# Altium project arduino_Nano.PrjPcb
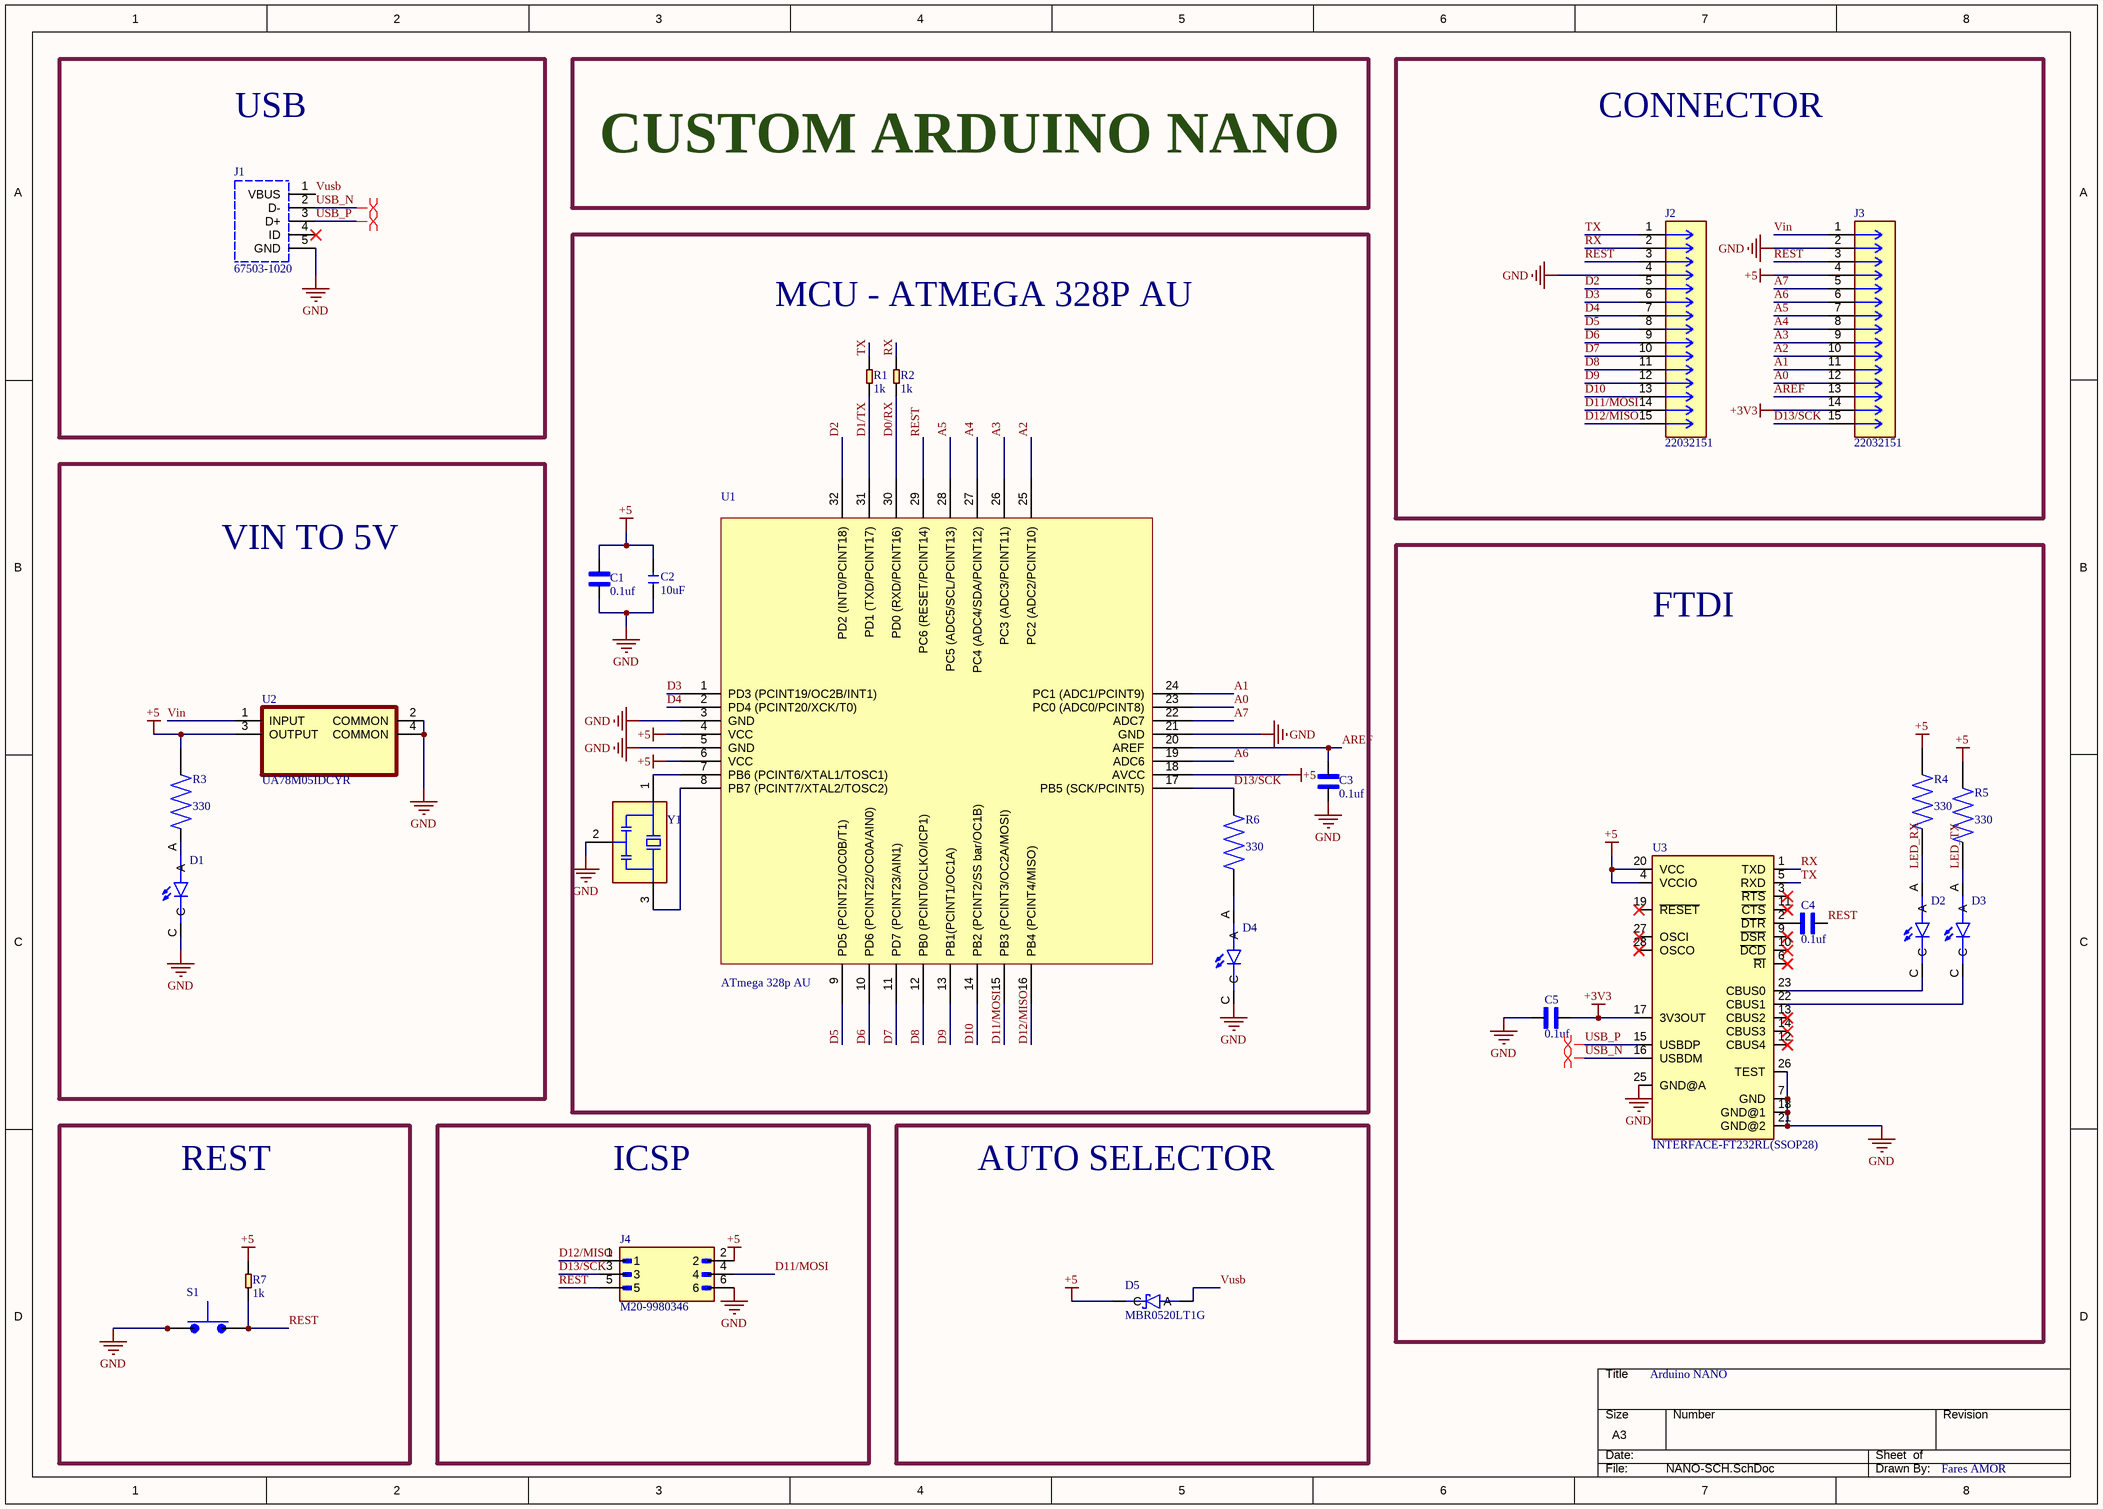
[diagram p0: NANO-SCH.SchDoc]
1 sheet, 26 parts. Net scope: global (net labels, ports and power ports of the same name join across sheets).
Board file: NANO-PCB.PcbDoc

## Sheet NANO-SCH.SchDoc
size A3; SheetNumber: 1; SheetTotal: 1

### Parts
C1  value 0.1uf  [CAPC1005X55N]  (hidden comment: CC0402KRX7R7BB104)
C2  value 10uF  [C0402]  (hidden comment: CERAMIC-10UF-6.3V-20%-X5R(0402))
C3  value 0.1uf  [CAPC1005X55N]  (hidden comment: CC0402KRX7R7BB104)
C4  value 0.1uf  [CAPC1005X55N]  (hidden comment: CC0402KRX7R7BB104)
C5  value 0.1uf  [CAPC1005X55N]  (hidden comment: CC0402KRX7R7BB104)
D1  LTST-C190GKT  [LEDM1608X80]  (value not drawn)
D2  LTST-C190GKT  [LEDM1608X80]  (value not drawn)
D3  LTST-C190GKT  [LEDM1608X80]  (value not drawn)
D4  LTST-C190GKT  [LEDM1608X80]  (value not drawn)
D5  MBR0520LT1G  [SOD3716X135N]
J1  67503-1020  [67503-1020]
J2  22032151  [CONN15X1_22032151_MOL]
J3  22032151  [CONN15X1_22032151_MOL]
J4  M20-9980346  [HARWIN_M20-9980346]
R1  value 1k  [R0402]  (hidden comment: SMD-RES-1K-5%-1/16W(0402))
R2  value 1k  [R0402]  (hidden comment: SMD-RES-1K-5%-1/16W(0402))
R3  value 330  [RESC1005X35N]  (hidden comment: RT0402BRD07330RL)
R4  value 330  [RESC1005X35N]  (hidden comment: RT0402BRD07330RL)
R5  value 330  [RESC1005X35N]  (hidden comment: RT0402BRD07330RL)
R6  value 330  [RESC1005X35N]  (hidden comment: RT0402BRD07330RL)
R7  value 1k  [R0402]  (hidden comment: SMD-RES-1K-5%-1/16W(0402))
S1  SKRPABE010  [SW_SKRPABE010]  (value not drawn)
U1  ATmega 328p AU  [ATmega328P]
U2  UA78M05IDCYR  [SOT230P700X180-4N]
U3  INTERFACE-FT232RL(SSOP28)  [SSOP28-0.65-10.2X5.2MM]
Y1  CSTCE16M0V53-R0  [OSC_CSTCE16M0V53-R0]  (value not drawn)

### Blocks framed on the sheet
USB: J1
CONNECTOR: J2 J3
MCU - ATMEGA 328P AU: C1-C3 D4 R1 R2 R6 U1 Y1
VIN TO 5V: D1 R3 U2
FTDI: C4 C5 D2 D3 R4 R5 U3
REST: R7 S1
ICSP: J4
AUTO SELECTOR: D5

### Nets
+3V3: C5.1 J3.14 U3.17(3V3OUT)
+5: C1.1 C2.2 D5.C J3.4 J4.2 R3.2 R4.2 R5.2 R7.2 U1.4(VCC) U1.6(VCC) U1.18(AVCC) U2.3(OUTPUT) U3.4(VCCIO) U3.20(VCC)
GND: C1.2 C2.1 C3.2 C5.2 D1.C D4.C J1.5(GND) J2.4 J3.2 J4.6 S1.1 S1.2 U1.3(GND) U1.5(GND) U1.21(GND) U2.2(COMMON) U2.4(COMMON) U3.7(GND) U3.18(GND@1) U3.21(GND@2) U3.25(GND@A) U3.26(TEST) Y1.2(GND)
A0: J3.12 U1.23(PC0_(ADC0/PCINT8))
A1: J3.11 U1.24(PC1_(ADC1/PCINT9))
A2: J3.10 U1.25(PC2_(ADC2/PCINT10))
A3: J3.9 U1.26(PC3_(ADC3/PCINT11))
A4: J3.8 U1.27(PC4_(ADC4/SDA/PCINT12))
A5: J3.7 U1.28(PC5_(ADC5/SCL/PCINT13))
A6: J3.6 U1.19(ADC6)
A7: J3.5 U1.22(ADC7)
AREF: C3.1 J3.13 U1.20(AREF)
D0/RX: R2.1 U1.30(PD0_(RXD/PCINT16))
D1/TX: R1.1 U1.31(PD1_(TXD/PCINT17))
D2: J2.5 U1.32(PD2_(INT0/PCINT18))
D3: J2.6 U1.1(PD3_(PCINT19/OC2B/INT1))
D4: J2.7 U1.2(PD4_(PCINT20/XCK/T0))
D5: J2.8 U1.9(PD5_(PCINT21/OC0B/T1))
D6: J2.9 U1.10(PD6_(PCINT22/OC0A/AIN0))
D7: J2.10 U1.11(PD7_(PCINT23/AIN1))
D8: J2.11 U1.12(PB0_(PCINT0/CLKO/ICP1))
D9: J2.12 U1.13(PB1(PCINT1/OC1A))
D10: J2.13 U1.14(PB2_(PCINT2/SS_bar/OC1B))
D11/MOSI: J2.14 J4.4 U1.15(PB3_(PCINT3/OC2A/MOSI))
D12/MISO: J2.15 J4.1 U1.16(PB4_(PCINT4/MISO))
D13/SCK: J3.15 J4.3 R6.2 U1.17(PB5_(SCK/PCINT5))
LED_RX: D2.A R4.1
LED_TX: D3.A R5.1
REST: C4.1 J2.3 J3.3 J4.5 R7.1 S1.3 S1.4 U1.29(PC6_(RESET/PCINT14))
RX: J2.2 R2.2 U3.1(TXD)
TX: J2.1 R1.2 U3.5(RXD)
USB_N: J1.2(D-) U3.16(USBDM)
USB_P: J1.3(D+) U3.15(USBDP)
Vin: J3.1 U2.1(INPUT)
Vusb: D5.A J1.1(VBUS)
NetC4_2: C4.2 U3.2(~{DTR})
NetD1_A: D1.A R3.1
NetD2_C: D2.C U3.23(CBUS0)
NetD3_C: D3.C U3.22(CBUS1)
NetD4_A: D4.A R6.1
NetU1_7: U1.7(PB6_(PCINT6/XTAL1/TOSC1)) Y1.1(IN)
NetU1_8: U1.8(PB7_(PCINT7/XTAL2/TOSC2)) Y1.3(OUT)

Not connected (* = marked no-connect by the designer): J1 4(ID)*; U3 3(~{RTS})* 6(~{RI})* 9(~{DSR})* 10(~{DCD})* 11(~{CTS})* 12(CBUS4)* 13(CBUS2)* 14(CBUS3)* 19(~{RESET})* 27(OSCI)* 28(OSCO)*

### Layout directives
differential pair; differential pair class DIFF90: USB_N, USB_P

### Notes on the sheet
- CUSTOM ARDUINO NANO
- Arduino NANO
- Fares AMOR

### Library data of the parts
C1 C3-C5 = CC0402KRX7R7BB104: 0.1 ÂµF Â±10% 16V Ceramic Capacitor X7R 0402 (1005 Metric); MF: Yageo; SnapEDA_Link: https://www.snapeda.com/parts/CC0402KRX7R7BB104/Yageo/view-part/?ref=snap; Package: 0402 Yageo; MP: CC0402KRX7R7BB104; Check_prices: https://www.snapeda.com/parts/CC0402KRX7R7BB104/Yageo/view-part/?ref=eda
C2 = CERAMIC-10UF-6.3V-20%-X5R(0402): 10 ÂµF Â±20% 6.3V Ceramic Capacitor X5R 0402 (1005 Metric); MF: Yageo; MP: CC0402MRX5R5BB106; SnapEDA_Link: https://www.snapeda.com/parts/CC0402MRX5R5BB106/Yageo/view-part/?ref=snap; Package: 0402 Yageo; Check_prices: https://www.snapeda.com/parts/CC0402MRX5R5BB106/Yageo/view-part/?ref=eda
D1-D4 = LTST-C190GKT: Green 1.6 x 0.8 x 0.8 mm 130Â° Water Clear 6 mcd 2.1 V SMT LED; Value: *; Price: None; Package: None; MP: LTST-C190GKT; Availability: Unavailable
D5 = MBR0520LT1G: Diode Schottky 20 V 500mA Surface Mount SOD-123; MF: ON Semiconductor; SnapEDA_Link: https://www.snapeda.com/parts/MBR0520LT1G/Onsemi/view-part/?ref=snap; Package: SOD-123-2 ON Semiconductor; Value: *; MP: MBR0520LT1G; Check_prices: https://www.snapeda.com/parts/MBR0520LT1G/Onsemi/view-part/?ref=eda
J1 = 67503-1020: Conn Data USB Mini-B SMT Rt Angle Solder Tabs On-The-Go PCB Pegs LF | Molex Incorporated 67503-1020; SnapEDA_Link: https://www.snapeda.com/parts/67503-1020/Molex/view-part/?ref=snap; Package: None; Value: *; MF: Molex; MP: 67503-1020; Check_prices: https://www.snapeda.com/parts/67503-1020/Molex/view-part/?ref=eda
R1 R2 R7 = SMD-RES-1K-5%-1/16W(0402): 301010006; MF: {'manufacturer': u'YAGEO'}; MP: RC0402JR-071KL; Package: None; Price: None; Availability: Unavailable
R3-R6 = RT0402BRD07330RL: 330 Ohms Â±0.1% 0.063W, 1/16W Chip Resistor 0402 (1005 Metric) Thin Film; MF: Yageo; SnapEDA_Link: https://www.snapeda.com/parts/RT0402BRD07330RL/Yageo/view-part/?ref=snap; Package: 1005 Yageo; MP: RT0402BRD07330RL; Check_prices: https://www.snapeda.com/parts/RT0402BRD07330RL/Yageo/view-part/?ref=eda
S1 = SKRPABE010: Switch Tactile N.O. SPST Button J-Bend 0.05A 16VDC 1.57N SMD Automotive T/R; MF: ALPS; SnapEDA_Link: https://www.snapeda.com/parts/SKRPABE010/ALPS/view-part/?ref=snap; Package: None; Value: *; MP: SKRPABE010; Check_prices: https://www.snapeda.com/parts/SKRPABE010/ALPS/view-part/?ref=eda
U1 = ATmega328p
U2 = UA78M05IDCYR: 500-mA, 30-V, linear voltage regulator; MF: Texas Instruments; SnapEDA_Link: https://www.snapeda.com/parts/UA78M05IDCYR/Texas+Instruments/view-part/?ref=snap; Package: SOT-223-4 Texas Instruments; Value: *; MP: UA78M05IDCYR; Check_prices: https://www.snapeda.com/parts/UA78M05IDCYR/Texas+Instruments/view-part/?ref=eda
U3 = INTERFACE-FT232RL(SSOP28): USB-Ð¼Ð¾ÑÑ‚, Ð¸Ð½Ñ‚ÐµÑ€Ñ„ÐµÐ¹Ñ USB Ðº UART USB 2.0 UART 28-SSOP; MF: FTDI, Future; SnapEDA_Link: https://www.snapeda.com/parts/FT232RL/FTDI%252C+Future+Technology+Devices+International+Ltd/view-part/?ref=snap; Availability: Not in stock; MP: FT232RL; Price: None; Value: *; Check_prices: https://www.snapeda.com/parts/FT232RL/FTDI%252C+Future+Technology+Devices+International+Ltd/view-part/?ref=eda; Package: SSOP-28 FTDI
Y1 = CSTCE16M0V53-R0: 16 MHz Ceramic Resonator Built in Capacitor 15 pF Â±0.3% -20Â°C ~ 80Â°C Surface Mount; MF: Murata; MP: CSTCE16M0V53-R0-; SnapEDA_Link: https://www.snapeda.com/parts/CSTCE16M0V53-R0-/Murata/view-part/?ref=snap; Package: None; Value: *; Check_prices: https://www.snapeda.com/parts/CSTCE16M0V53-R0-/Murata/view-part/?ref=eda
J2 J3 = 22032151: Package: None; Price: None; Value: *; MP: 22032151; Availability: Unavailable
J4 = M20-9980346: Package: None; Price: None; Value: *; MP: M20-9980346; Availability: Unavailable